# Altium schematic sheet Sheet3.SchDoc
size A
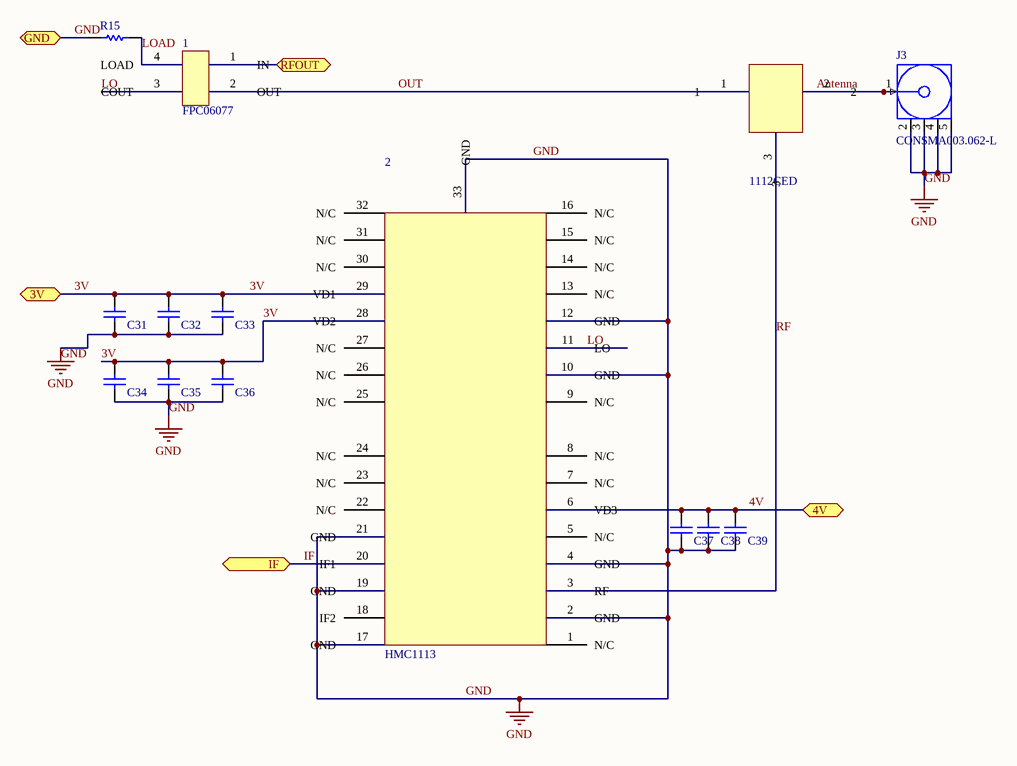
[diagram p0: Sheet3.SchDoc]

## Parts
1  FPC06077  [FPC06077]
2  HMC1113  [QFN50P500X500X5_HS-33N]
1112CED  (no value)  [PCBComponent_1]
C31  CAP 2.2uF 16V 0603(1608)  [CAPC0603(1608)100_L]  (value not drawn)
C32  CAP 10nF 16V 0603(1608)  [CAPC0603(1608)100_L]  (value not drawn)
C33  CAP 100pF 16V 0603(1608)  [CAPC0603(1608)100_L]  (value not drawn)
C34  CAP 2.2uF 16V 0603(1608)  [CAPC0603(1608)100_L]  (value not drawn)
C35  CAP 10nF 16V 0603(1608)  [CAPC0603(1608)100_L]  (value not drawn)
C36  CAP 100pF 16V 0603(1608)  [CAPC0603(1608)100_L]  (value not drawn)
C37  CAP 100pF 16V 0603(1608)  [CAPC0603(1608)100_L]  (value not drawn)
C38  CAP 10nF 16V 0603(1608)  [CAPC0603(1608)100_L]  (value not drawn)
C39  CAP 2.2uF 16V 0603(1608)  [CAPC0603(1608)100_L]  (value not drawn)
J3  CONSMA003.062-L  [CON-SMA-EDGE062L]
R15  50R 5% 0805(2012)  [RESC0805(2012)_N]  (value not drawn)

## Ports
3V, 4V, GND, IF, RFOUT

## Nets
GND: 2.2(GND) 2.4(GND) 2.10(GND) 2.12(GND) 2.17(GND) 2.19(GND) 2.21(GND) 2.33(GND) C31.2 C32.2 C33.2 C34.2 C35.2 C36.2 C37.2 C38.2 C39.2 J3.2(GND) J3.3(GND) J3.4(GND) J3.5(GND) R15.1 ; port GND
3V: 2.28(VD2) 2.29(VD1) C31.1 C32.1 C33.1 C34.1 C35.1 C36.1 ; port 3V
4V: 2.6(VD3) C37.1 C38.1 C39.1 ; port 4V
Antenna: 1112CED.2 J3.1(Signal)
IF: 2.20(IF1) ; port IF
LO: 1.3(COUT) 2.11(LO)
LOAD: 1.4(LOAD) R15.2
OUT: 1.2(OUT) 1112CED.1
RF: 2.3(RF) 1112CED.3
RFOUT: 1.1(IN) ; port RFOUT

Not connected (* = marked no-connect by the designer): 2 1(N/C) 5(N/C) 7(N/C) 8(N/C) 9(N/C) 13(N/C) 14(N/C) 15(N/C) 16(N/C) 18(IF2) 22(N/C) 23(N/C) 24(N/C) 25(N/C) 26(N/C) 27(N/C) 30(N/C) 31(N/C) 32(N/C)

## Notes on the sheet
- Labels drawn without touching a wire or pin: GND

## Library data of the parts
1112CED = Component_1
C31 C34 C39 = CMP-1035-01744-1: CAP 2.2uF 16V ±1% 0603 (1608 Metric) Thickness 1mm SMD; Tolerance: Â±1%; Case-Metric: 1608; Case-EIA: 0603; Technology: SMT; Max Thickness: 1 mm; Value: 2.2uF; Rated Voltage: 16 V
C32 C35 C38 = CMP-1035-01744-1: CAP 10nF 16V ±1% 0603 (1608 Metric) Thickness 1mm SMD; Tolerance: Â±1%; Case-Metric: 1608; Case-EIA: 0603; Technology: SMT; Max Thickness: 1 mm; Value: 10nF; Rated Voltage: 16 V
C33 C36 C37 = CMP-1035-01744-1: CAP 100pF 16V ±1% 0603 (1608 Metric) Thickness 1mm SMD; Tolerance: Â±1%; Case-Metric: 1608; Case-EIA: 0603; Technology: SMT; Max Thickness: 1 mm; Value: 100pF; Rated Voltage: 16 V
J3 = CMP-0168-00039-1: PCB_Layout: Pads complies with manufacturer's recommendation.; DatasheetVersion: rev1.0, May-2007; PackageReference: CON-SMA-EDGE062L; PackageVersion: rev1.0, May-2007
R15 = CMP-1013-00037-1: 50R 0.125W 5% 0805 (2012 Metric)  SMD; Case-Metric: 2012; Value: 50 Ohm; Case-EIA: 0805; Power: 0.125 W; Technology: SMT; Tolerance: 5 %